# EAGLE design Power_supply2 (EAGLE 6.1)
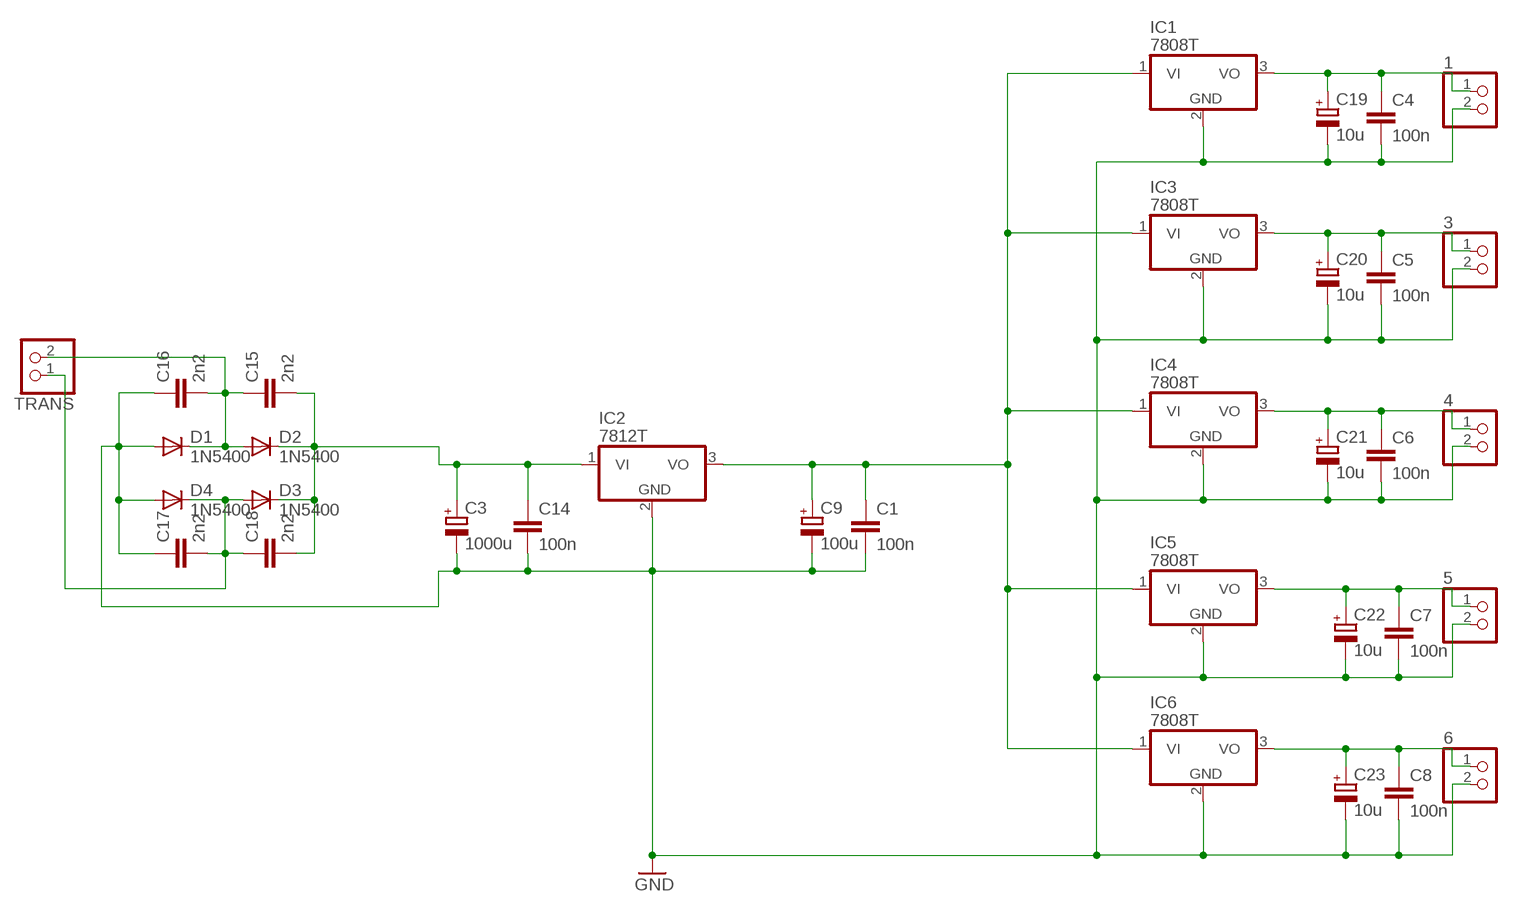
[diagram p0: schematic, sheet 1]

## Parts
1  PINHD-1X2  [1X02]
3  PINHD-1X2  [1X02]
4  PINHD-1X2  [1X02]
5  PINHD-1X2  [1X02]
6  PINHD-1X2  [1X02]
C1  100n  C-EUC0805  [C0805]
C3  1000u  CPOL-EUE5-13  [E5-13]
C4  100n  C-EUC0805  [C0805]
C5  100n  C-EUC0805  [C0805]
C6  100n  C-EUC0805  [C0805]
C7  100n  C-EUC0805  [C0805]
C8  100n  C-EUC0805  [C0805]
C9  100u  CPOL-EUE2.5-6  [E2,5-6]
C14  100n  C-EUC0805  [C0805]
C15  2n2  C-EUC0805  [C0805]
C16  2n2  C-EUC0805  [C0805]
C17  2n2  C-EUC0805  [C0805]
C18  2n2  C-EUC0805  [C0805]
C19  10u  CPOL-EUCT7343  [CT7343]
C20  10u  CPOL-EUCT7343  [CT7343]
C21  10u  CPOL-EUCT7343  [CT7343]
C22  10u  CPOL-EUCT7343  [CT7343]
C23  10u  CPOL-EUCT7343  [CT7343]
D1  1N5400  [DO201-15]
D2  1N5400  [DO201-15]
D3  1N5400  [DO201-15]
D4  1N5400  [DO201-15]
IC1  7808T  [TO220H]
IC2  7812T  [TO220H]
IC3  7808T  [TO220H]
IC4  7808T  [TO220H]
IC5  7808T  [TO220H]
IC6  7808T  [TO220H]
TRANS  PINHD-1X2  [1X02]

## Nets
GND: 1.2 3.2 4.2 5.2 6.2 C1.2 C3.- C4.2 C5.2 C6.2 C7.2 C8.2 C9.- C14.2 C16.1 C17.1 C19.- C20.- C21.- C22.- C23.- D1.A D4.A IC1.2(GND) IC2.2(GND) IC3.2(GND) IC4.2(GND) IC5.2(GND) IC6.2(GND)
N$2: 4.1 C6.1 C21.+ IC4.3(VO)
N$3: 5.1 C7.1 C22.+ IC5.3(VO)
N$4: 1.1 C4.1 C19.+ IC1.3(VO)
N$5: C1.1 C9.+ IC1.1(VI) IC2.3(VO) IC3.1(VI) IC4.1(VI) IC5.1(VI) IC6.1(VI)
N$6: 3.1 C5.1 C20.+ IC3.3(VO)
N$7: 6.1 C8.1 C23.+ IC6.3(VO)
N$9: C15.1 C16.2 D1.C D2.A TRANS.2
N$10: C3.+ C14.1 C15.2 C18.2 D2.C D3.C IC2.1(VI)
N$11: C17.2 C18.1 D3.A D4.C TRANS.1

## Library data of the parts
1 3-6 TRANS = pinhead:PINHD-1X2: PIN HEADER
C1 C4-C8 C14-C18 = resistor:C-EU: CAPACITOR, European symbol
C3 C9 C19-C23 = resistor:CPOL-EU: POLARIZED CAPACITOR, European symbol
D1-D4 = diode:1N5400: DIODE standard rectifier, 3 A, 50 V (Motorola)
IC1-IC6 = linear:78*: Positive VOLTAGE REGULATOR Source: http://cache.national.com/ds/LM/LM78L05.pdf http://www.fairchildsemi.com/ds/LM/LM7805.pdf

## Board
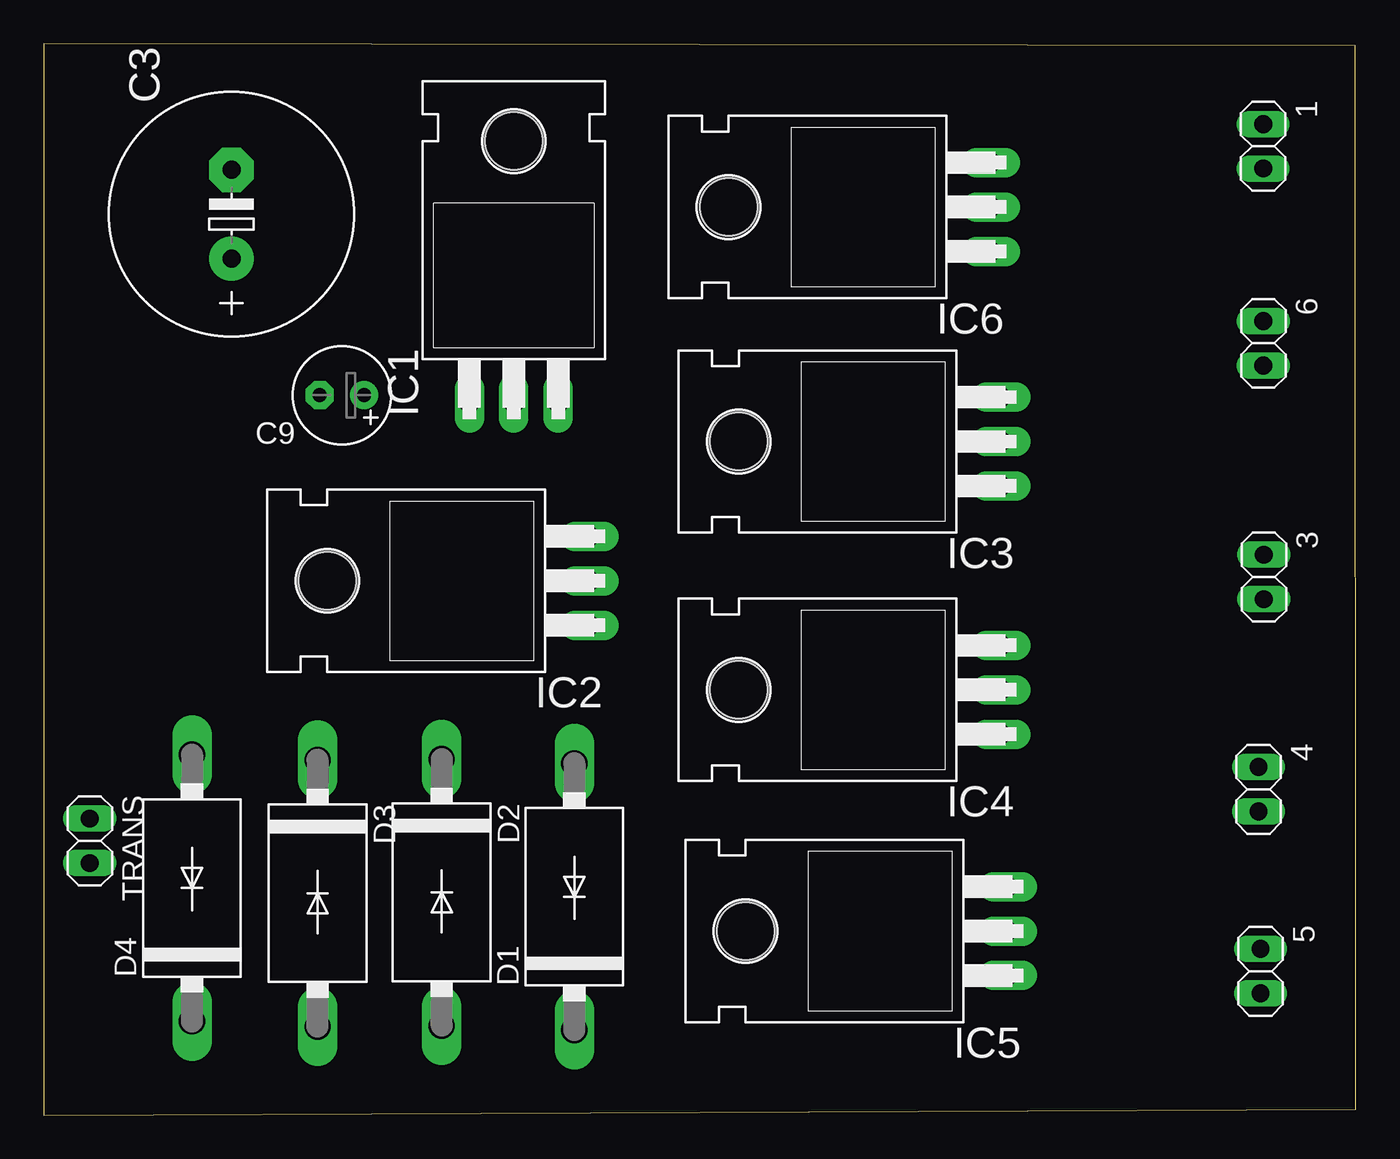
[diagram p1: board, top side]
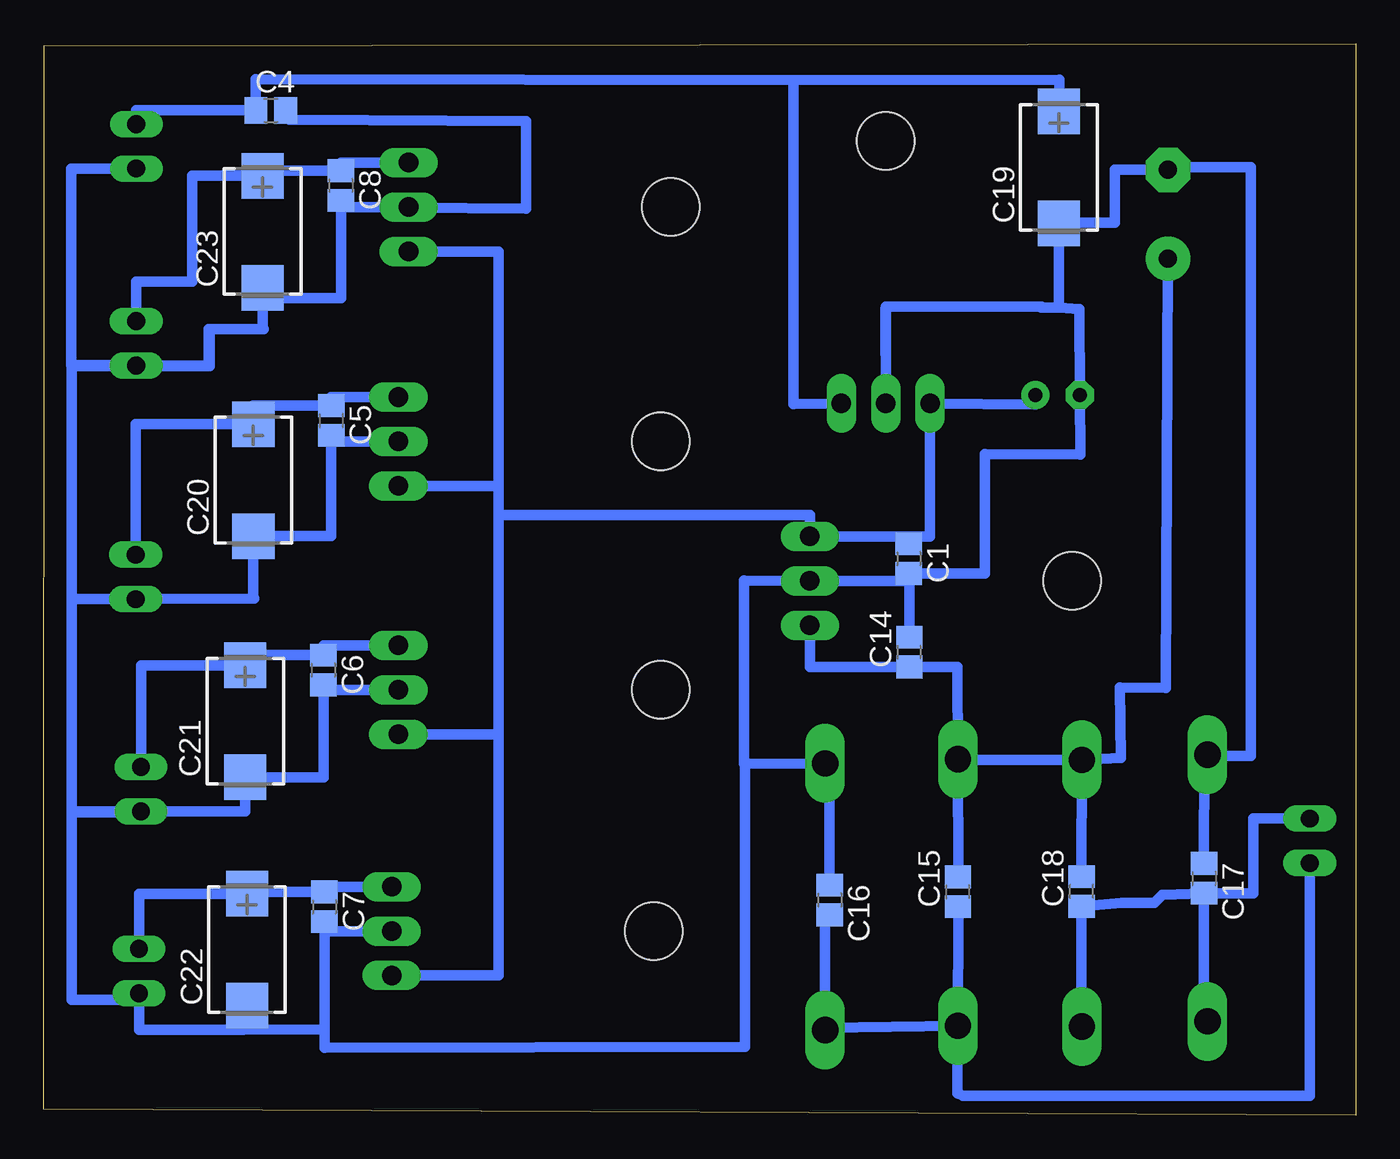
[diagram p2: board, bottom side, seen from below]

Size 74.97 x 61.23 mm. Coordinates in mm from the lower left corner, seen from the top.
Outline: 0,0 74.97,0.33 74.93,61.13 0,61.23 0,0
Copper layers (1*16): Top 0.035mm / dielectric 1.5mm / Bottom 0.035mm
Design rules: minimum track width 10mil, minimum drill 24mil, track to track 8mil, track to pad 8mil, pad to pad 8mil, via to via 8mil, smd to smd 8mil, copper to edge 40mil, drill to drill 8mil, minimum pad ring 10mil, minimum via ring 8mil, stop-mask expansion 4mil, vias tented up to drill 0mil, thermal gap 10mil

### Footprints (pad centres in the part's own frame; a part is rotated, then mirrored left to right if it is on the bottom)
1X02 = drill 1.016 long: 1 -1.27,0; 2 1.27,0
C0805 = smd 1.3 x 1.5: 1 -0.85,0; 2 0.85,0
E5-13 = drill 1.016 pad 2.54: + -2.54,0 | drill 1.016 pad 2.54 octagon: - 2.54,0
E2,5-6 = drill 0.813 pad 1.6: + -1.27,0 | drill 0.813 pad 1.6 octagon: - 1.27,0
CT7343 = smd 2.6 x 2.4: + 3.2,0; - -3.2,0
DO201-15 = drill 1.499 long: A 7.62,0; C -7.62,0
TO220H = drill 1.118 long: 1 -2.54,-10.16; 2 0,-10.16; 3 2.54,-10.16 | hole 3.302: 0,4.826

### Placement (x,y rotation side)
1  69.68,55.37 270 top
3  69.72,30.76 270 top
4  69.41,18.63 270 top
5  69.53,8.23 270 top
6  69.69,44.11 270 top
C1  25.54,31.81 270 bottom
C3  10.73,51.49 90 top
C4  62,57.42 0 bottom
C5  58.54,39.7 270 bottom
C6  58.99,25.44 270 bottom
C7  58.93,11.91 270 bottom
C8  57.99,53.13 270 bottom
C9  17.04,41.15 180 top
C14  25.51,26.46 90 bottom
C15  22.74,12.77 90 bottom
C16  30.06,12.3 270 bottom
C17  8.67,13.54 270 bottom
C18  15.67,12.79 90 bottom
C19  16.96,54.15 90 bottom
C20  62.99,36.29 90 bottom
C21  63.45,22.51 90 bottom
C22  63.36,9.46 90 bottom
C23  62.47,50.49 90 bottom
D1  30.32,12.49 90 top
D2  22.74,12.73 270 top
D3  15.65,12.69 270 top
D4  8.47,12.98 90 top
IC1  26.86,50.84 0 top
IC2  21.03,30.54 90 top
IC3  44.54,38.5 90 top
IC4  44.54,24.31 90 top
IC5  44.93,10.52 90 top
IC6  43.96,51.9 90 top
TRANS  2.63,15.68 270 top

### Tracks (layer width: path | path; a pad name or v marks a point on that pad's centre or on a via)
GND
  Bottom 0.61: 25.54,30.54 IC2.2 34.95,30.56 34.95,20.09 | 25.54,30.54 C1.2 21.18,30.96 21.18,37.79 15.75,37.74 C9.- 15.78,46.06 16.96,46.15 | D4.A 8.65,20.54 | 8.65,20.54 C17.1 | C16.1 30.06,20.11 D1.A 30.32,20.07 34.95,20.09 | 25.54,30.54 25.51,30.54 C14.2 | 26.88,46.1 IC1.2 26.86,46.2 17.97,46.2 17.97,46.15 16.96,46.15 | 63.57,4.89 69.53,4.89 5.2 69.53,6.59 73.38,6.59 73.38,17.36 4.2 | 63.57,4.89 58.93,4.9 | 54.7,24.35 IC4.2 58.99,24.31 C6.2 58.99,19.31 C21.- 63.45,17.36 4.2 | 3.2 63.17,29.52 | 63.17,29.52 62.95,29.52 | 65.49,44.93 65.54,44.93 65.54,42.84 6.2 69.69,42.86 73.41,42.86 73.41,54.1 1.2 | 65.49,44.93 62.4,44.91 62.47,44.91 62.47,46.69 | 65.49,44.93 65.49,42.81 73.38,42.81 73.38,29.51 69.72,29.51 3.2 | 3.2 73.38,29.49 73.38,17.3 69.41,17.3 4.2 | 34.95,20.09 34.9,20.07 34.9,3.91 58.91,3.86 58.93,4.9 | C4.2 60.93,57.42 60.93,56.89 47.41,56.81 47.41,51.8 54.12,51.85 IC6.2 57.99,51.9 C8.2 57.99,46.69 62.47,46.69 | IC5.2 58.93,10.52 | 58.93,10.52 C7.2 | 58.93,4.89 58.93,4.9 | 58.93,4.9 58.93,10.52 | C22.- 63.57,6.26 63.57,4.89 | 63.17,29.52 62.99,29.52 C20.- 58.54,33.09 58.54,38.5 | IC3.2 58.54,38.5 | 58.54,38.5 C5.2 | 62.47,46.69 C23.- | 16.96,46.15 C19.- 16.96,51.02 13.77,51.02 13.77,54.03 C3.- 10.73,54.17 6,54.17 6,20.54 8.65,20.54
N$2
  Bottom 0.61: 4.1 69.41,25.71 C21.+ 63.45,26.29 C6.1 58.99,26.85 IC4.3
N$3
  Bottom 0.61: IC5.3 58.93,13.06 C7.1 63.36,12.76 C22.+ 69.53,12.66 5.1
N$4
  Bottom 0.61: 32.13,59.16 32.13,40.63 IC1.3 | 1.1 69.68,57.42 C4.1 62.85,59.21 32.13,59.16 | 32.13,59.16 16.94,59.17 C19.+
N$5
  Bottom 0.61: C1.1 25.54,33.08 | 25.54,33.08 IC2.3 31.2,34.31 48.98,34.31 | IC4.1 48.97,21.77 | 48.97,21.77 48.97,8 55.09,8 IC5.1 | IC3.1 48.97,35.96 | 48.97,35.96 48.98,34.31 | 48.98,34.31 48.97,21.77 | IC6.1 48.97,49.36 48.97,35.96 | 25.54,33.08 24.32,33.08 IC1.1 18.32,40.6 C9.+
N$6
  Bottom 0.61: 3.1 69.72,39.49 C20.+ 62.99,40.55 C5.1 58.54,41.04 IC3.3
N$7
  Bottom 0.61: 6.1 69.69,47.65 66.49,47.65 66.49,53.68 C23.+ 62.47,53.98 C8.1 57.99,54.44 IC6.3
N$9
  Bottom 0.61: D2.A 30.32,4.99 D1.C 30.32,11.45 C16.2 | C15.1 22.71,11.57 D2.A | D2.A 22.76,1.24 22.44,1.1 2.63,1.1 TRANS.2
N$10
  Bottom 0.61: D3.C 22.88,20.31 D2.C | C18.2 15.68,13.62 D3.C | C15.2 22.7,13.72 D2.C | C3.+ 10.85,24.42 13.48,24.44 13.42,20.43 D3.C | D2.C 22.77,25.61 C14.1 31.19,25.61 IC2.1
N$11
  Bottom 0.61: D3.A 15.56,4.67 15.69,4.34 15.69,11.91 C18.1 13.36,12.13 11.51,12.13 11.05,12.59 C17.2 | C17.2 8.68,5.34 D4.C | TRANS.1 5.84,16.95 5.84,12.67 8.67,12.67 C17.2